# Altium schematic sheet Indicators.SchDoc
size A; SheetNumber: 8; SheetTotal: 8
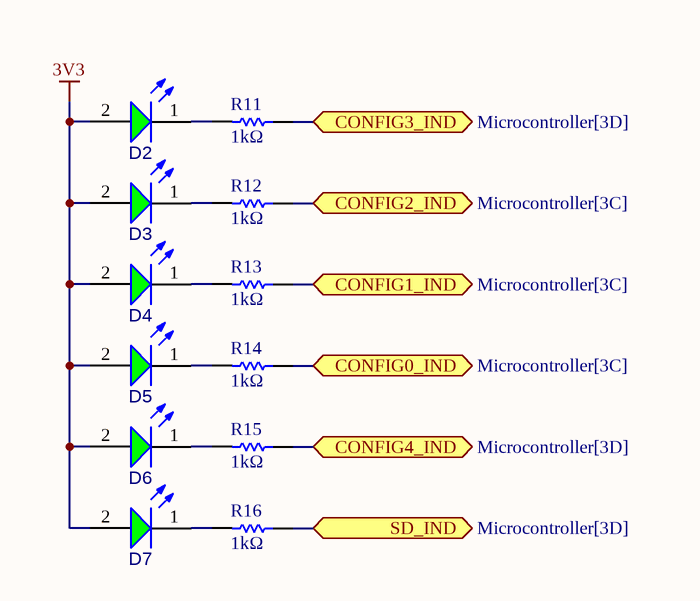
[diagram p0: Indicators.SchDoc]

## Parts
D2  150120GS75000  [WL-SMCW_1206_150120xx75000]  (value not drawn)
D3  150120GS75000  [WL-SMCW_1206_150120xx75000]  (value not drawn)
D4  150120GS75000  [WL-SMCW_1206_150120xx75000]  (value not drawn)
D5  150120GS75000  [WL-SMCW_1206_150120xx75000]  (value not drawn)
D6  150120GS75000  [WL-SMCW_1206_150120xx75000]  (value not drawn)
D7  150120GS75000  [WL-SMCW_1206_150120xx75000]  (value not drawn)
R11  1kΩ  [RESC3116X65X40LL10T20]
R12  1kΩ  [RESC3116X65X40LL10T20]
R13  1kΩ  [RESC3116X65X40LL10T20]
R14  1kΩ  [RESC3116X65X40LL10T20]
R15  1kΩ  [RESC3116X65X40LL10T20]
R16  1kΩ  [RESC3116X65X40LL10T20]

## Ports
CONFIG0_IND (bidir, see Microcontroller[3C]), CONFIG1_IND (bidir, see Microcontroller[3C]), CONFIG2_IND (bidir, see Microcontroller[3C]), CONFIG3_IND (bidir, see Microcontroller[3D]), CONFIG4_IND (bidir, see Microcontroller[3D]), SD_IND (bidir, see Microcontroller[3D])

## Nets
3V3: D2.2(A) D3.2(A) D4.2(A) D5.2(A) D6.2(A) D7.2(A)
CONFIG0_IND: R14.1 ; port CONFIG0_IND
CONFIG1_IND: R13.1 ; port CONFIG1_IND
CONFIG2_IND: R12.1 ; port CONFIG2_IND
CONFIG3_IND: R11.1 ; port CONFIG3_IND
CONFIG4_IND: R15.1 ; port CONFIG4_IND
SD_IND: R16.1 ; port SD_IND
NetD2_1: D2.1(K) R11.2
NetD3_1: D3.1(K) R12.2
NetD4_1: D4.1(K) R13.2
NetD5_1: D5.1(K) R14.2
NetD6_1: D6.1(K) R15.2
NetD7_1: D7.1(K) R16.2

## Library data of the parts
D2-D7 = CMP-1426-00014-4: WL-SMCW SMT Mono-Color Chip LED Waterclear; Dominant Wavelength: 525nm; Reverse Voltage: 5V; Max Junction Temperature (Tj): 95°C; Lens Style: Clear, Rectangular; Forward Voltage: 3.2V; Power Dissipation: 105mW; Peak Wavelength: 515nm; Test Current: 20mA; Color: Green; Forward Current: 100mA; Luminous Intensity: 450mcd; Viewing Angle: 140°; Case Code (Imperial): 1206; REACH SVHC: Unknown; Packaging: Tape and Reel; Max Operating Temperature: 85°C; Case/Package: 1206; Height: 680µm; Length: 3.2mm; Mount: Surface Mount; Min Operating Temperature: -40°C; Width: 1.6mm; Case Code (Metric): 3216; Max Reverse Voltage (DC): 5V; RoHS: Compliant; Wavelength: 525nm
R11-R16 = CMP-2100-03678-1: Chip Resistor, 1 KOhm, +/- 1%, 0.25 W, -55 to 155 degC, 1206 (3216 Metric), RoHS, Tape and Reel; Manufacturer: Yageo; Temperature Coefficient: 100ppm/degreesC; Power Rating: 250mW; Voltage Rating: 200V; Resistance: 1KOhm; Composition: ThickFilm; Min Operating Temperature: -55degC; Tolerance: 1%; REACH SVHC: Unknown; Case Code (Metric): 3216; Military Standard: Not; Datasheet Version: Rev. 5, 10/2016; Package Reference: 1206.0; Case/Package: 1206; Length: 3.1mm; Manufacturer URL: http://www.yageo.com/; Lead Free: LeadFree; RoHSCompliant: true; Termination: SMD/SMT; Packaging: TapeandReel; Package Description: 2-Pin Surface Mount Device, Body 3.1 x 1.6 mm; Depth: 1.6mm; Case Code (Imperial): 1206; Max Operating Temperature: 155degC; Datasheet URL: http://www.yageo.com/NewPortal/yageodocoutput?fileName=/pdf/R-Chip/PYu-RC_Group_51_RoHS_L_5.pdf; Height: 0.55mm